# EAGLE design porcupine5v1_2 (EAGLE 5.11)
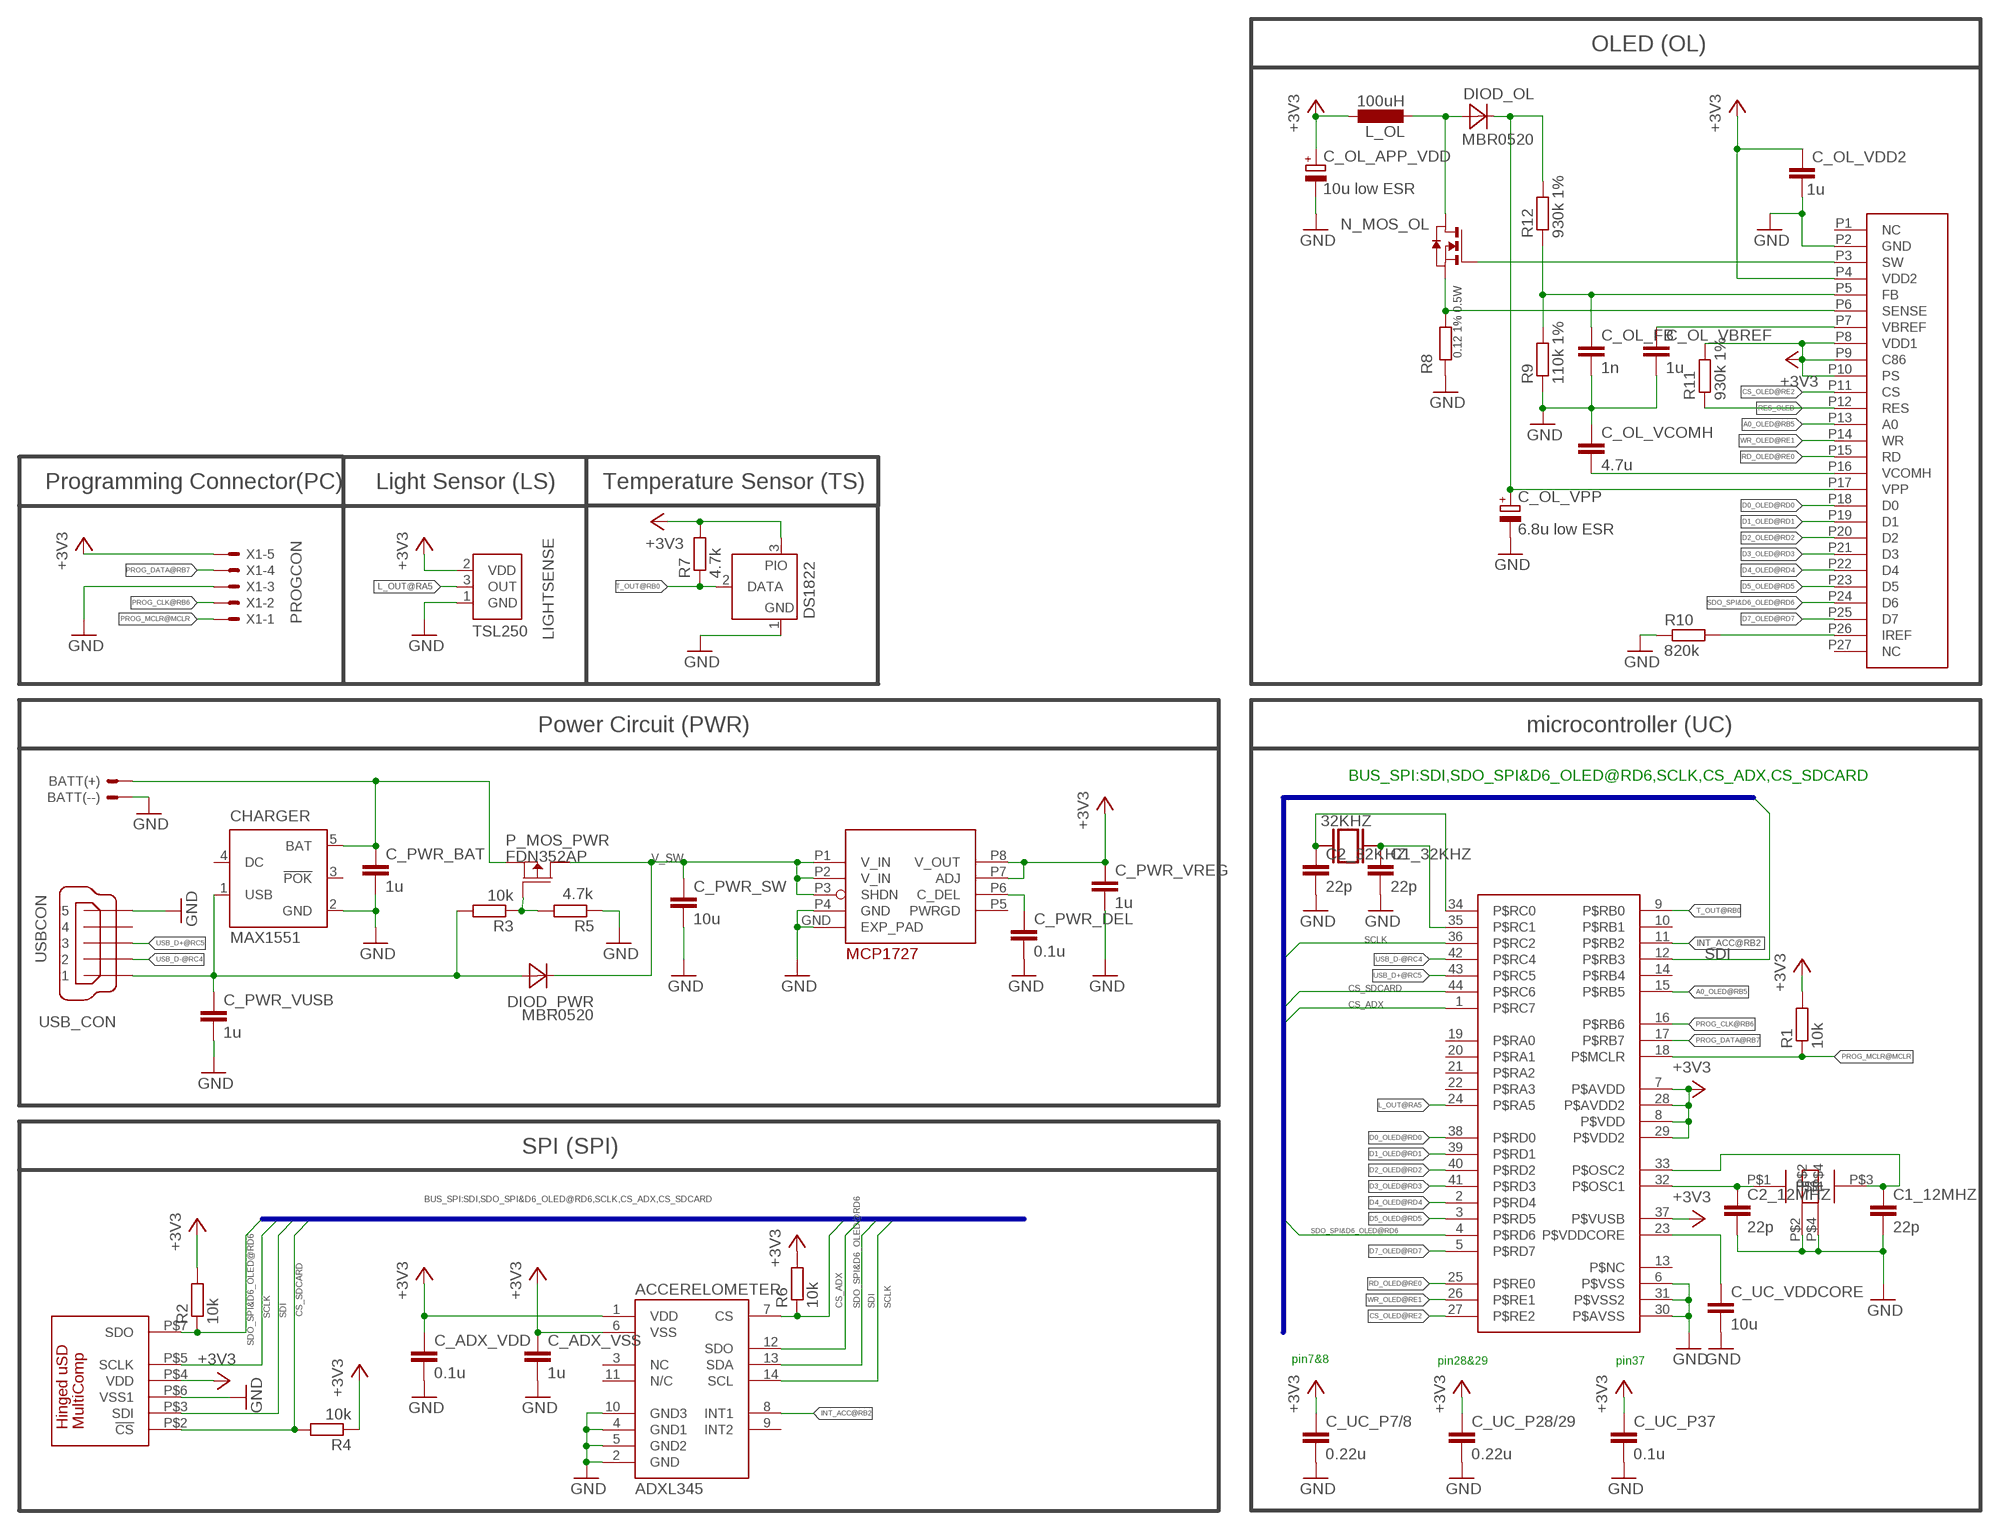
[diagram p0: schematic, sheet 1]

## Parts
ACCERELOMETER  ADXL345  [LGA14]
BATT  LI-ION-PACK  [LI-ION-CONNECT]
C1_12MHZ  22p  C-EUC0603K  [C0603K]
C1_32KHZ  22p  C-EUC0603K  [C0603K]
C2_12MHZ  22p  C-EUC0603K  [C0603K]
C2_32KHZ  22p  C-EUC0603K  [C0603K]
C_ADX_VDD  0.1u  C-EUC0603K  [C0603K]
C_ADX_VSS  1u  C-EUC0603K  [C0603K]
C_OL_APP_VDD  10u low ESR  CPOL-EUA/3216-18R  [A/3216-18R]
C_OL_FB  1n  C-EUC0603K  [C0603K]
C_OL_VBREF  1u  C-EUC0603K  [C0603K]
C_OL_VCOMH  4.7u  C-EUC0603K  [C0603K]
C_OL_VDD2  1u  C-EUC0603K  [C0603K]
C_OL_VPP  6.8u low ESR  CPOL-EUA/3216-18R  [A/3216-18R]
C_PWR_BAT  1u  C-EUC0603K  [C0603K]
C_PWR_DEL  0.1u  C-EUC0603K  [C0603K]
C_PWR_SW  10u  C-EUC0805K  [C0805K]
C_PWR_VREG  1u  C-EUC0603K  [C0603K]
C_PWR_VUSB  1u  C-EUC0603K  [C0603K]
C_UC_P7/8  0.22u  C-EUC0603K  [C0603K]
C_UC_P28/29  0.22u  C-EUC0603K  [C0603K]
C_UC_P37  0.1u  C-EUC0603K  [C0603K]
C_UC_VDDCORE  10u  C-EUC0805K  [C0805K]
CHARGER  MAX1551  [SOT23-5L]
CON_OLED  OLED_DENSITRON  [CON_DD-12864WE-1A]
CRYSTAL_12MHZ  12MHZSMDCRYSTAL  [ABM3B]
CRYSTAL_32KHZ  32KHZ  XTALSLOW  [TC26HSMD]
DIOD_OL  MBR0520  [SOD123]
DIOD_PWR  MBR0520  [SOD123]
L_OL  100uH  LQH3NP  [1212_FOR_INDUCTANCE]
LIGHTSENSE  TSL250  [TSL]
N_MOS_OL  MGSF1N02LT1  [SOT-23]
P_MOS_PWR  FDN352AP  [SUPERSOT-3]
PIC_CONTROLLER  PIC_P2V6  [QFN44ML8X8]
R1  10k  R-EU_R0603  [R0603]
R2  10k  R-EU_R0603  [R0603]
R3  10k  R-EU_R0603  [R0603]
R4  10k  R-EU_R0603  [R0603]
R5  4.7k  R-EU_R0603  [R0603]
R6  10k  R-EU_R0603  [R0603]
R7  4.7k  R-EU_R0603  [R0603]
R8  0.12 1% 0.5W  RESISTOR_PAN_ERJB3CFR12V  [0805_UPSIDEDOWN]
R9  110k 1%  R-EU_R0603  [R0603]
R10  820k  R-EU_R0603  [R0603]
R11  930k 1%  R-EU_R0603  [R0603]
R12  930k 1%  R-EU_R0603  [R0603]
SDCARD_CON  MICROSD_CONN  [460DA40013]
TEMPSENSE  DS1822  DS2405  [TO92-]
USB_CON  USBCON  [248601]
VOLTAGEREG  MCP1727  [MCP_DFN_3X3X0.9]
X1  PROGCON  [53047-05-OCT]

## Nets
+3V3: ACCERELOMETER.1(VDD) ACCERELOMETER.6(VSS) C_ADX_VDD.1 C_ADX_VSS.1 C_OL_APP_VDD.+ C_OL_VDD2.2 C_PWR_VREG.1 C_UC_P7/8.1 C_UC_P28/29.1 C_UC_P37.1 CON_OLED.P4(VDD2) CON_OLED.P8(VDD1) CON_OLED.P9(C86) CON_OLED.P10(PS) L_OL.P$1 LIGHTSENSE.2(VDD) PIC_CONTROLLER.7(P$AVDD) PIC_CONTROLLER.8(P$VDD) PIC_CONTROLLER.28(P$AVDD2) PIC_CONTROLLER.29(P$VDD2) PIC_CONTROLLER.37(P$VUSB) R1.2 R2.2 R4.1 R6.2 R7.2 R11.2 SDCARD_CON.P$4(VDD) TEMPSENSE.3(PIO) VOLTAGEREG.P7(ADJ) VOLTAGEREG.P8(V_OUT) X1.5
A0_OLED@RB5: CON_OLED.P13(A0) PIC_CONTROLLER.15(P$RB5)
CS_ADX: ACCERELOMETER.7(CS) PIC_CONTROLLER.1(P$RC7) R6.1
CS_OLED@RE2: CON_OLED.P11(CS) PIC_CONTROLLER.27(P$RE2)
CS_SDCARD: PIC_CONTROLLER.44(P$RC6) R4.2 SDCARD_CON.P$2(!CS)
D0_OLED@RD0: CON_OLED.P18(D0) PIC_CONTROLLER.38(P$RD0)
D1_OLED@RD1: CON_OLED.P19(D1) PIC_CONTROLLER.39(P$RD1)
D2_OLED@RD2: CON_OLED.P20(D2) PIC_CONTROLLER.40(P$RD2)
D3_OLED@RD3: CON_OLED.P21(D3) PIC_CONTROLLER.41(P$RD3)
D4_OLED@RD4: CON_OLED.P22(D4) PIC_CONTROLLER.2(P$RD4)
D5_OLED@RD5: CON_OLED.P23(D5) PIC_CONTROLLER.3(P$RD5)
D7_OLED@RD7: CON_OLED.P25(D7) PIC_CONTROLLER.5(P$RD7)
GND: ACCERELOMETER.2(GND) ACCERELOMETER.4(GND1) ACCERELOMETER.5(GND2) ACCERELOMETER.10(GND3) BATT.2 C1_12MHZ.2 C1_32KHZ.2 C2_12MHZ.2 C2_32KHZ.2 C_ADX_VDD.2 C_ADX_VSS.2 C_OL_APP_VDD.- C_OL_FB.2 C_OL_VBREF.2 C_OL_VCOMH.1 C_OL_VDD2.1 C_OL_VPP.- C_PWR_BAT.2 C_PWR_DEL.2 C_PWR_SW.2 C_PWR_VREG.2 C_PWR_VUSB.2 C_UC_P7/8.2 C_UC_P28/29.2 C_UC_P37.2 C_UC_VDDCORE.2 CHARGER.2(GND) CON_OLED.P2(GND) CRYSTAL_12MHZ.P$2 CRYSTAL_12MHZ.P$4 LIGHTSENSE.1(GND) PIC_CONTROLLER.6(P$VSS) PIC_CONTROLLER.30(P$AVSS) PIC_CONTROLLER.31(P$VSS2) R5.1 R8.P$2 R9.1 R10.1 SDCARD_CON.P$6(VSS1) TEMPSENSE.1(GND) USB_CON.5 VOLTAGEREG.GND(EXP_PAD) VOLTAGEREG.P4(GND) X1.3
INT_ACC@RB2: ACCERELOMETER.8(INT1) PIC_CONTROLLER.11(P$RB2)
L_OUT@RA5: LIGHTSENSE.3(OUT) PIC_CONTROLLER.24(P$RA5)
N$2: P_MOS_PWR.1(G) R3.1 R5.2
N$3: C2_32KHZ.1 CRYSTAL_32KHZ.P$2 PIC_CONTROLLER.34(P$RC0)
N$4: C_PWR_DEL.1 VOLTAGEREG.P6(C_DEL)
N$6: C1_32KHZ.1 CRYSTAL_32KHZ.P$1 PIC_CONTROLLER.35(P$RC1)
N$8: C_UC_VDDCORE.1 PIC_CONTROLLER.23(P$VDDCORE)
N$10: DIOD_OL.A L_OL.P$2 N_MOS_OL.1(D)
N$11: CON_OLED.P3(SW) N_MOS_OL.3(G)
N$12: C_OL_VPP.+ CON_OLED.P17(VPP) DIOD_OL.C R12.2
N$13: CON_OLED.P6(SENSE) N_MOS_OL.2(S) R8.P$3
N$15: C_OL_FB.1 CON_OLED.P5(FB) R9.2 R12.1
N$18: C_OL_VBREF.1 CON_OLED.P7(VBREF)
N$21: C_OL_VCOMH.2 CON_OLED.P16(VCOMH)
N$30: CON_OLED.P26(IREF) R10.2
OSC3: C2_12MHZ.1 CRYSTAL_12MHZ.P$1 PIC_CONTROLLER.32(P$OSC1)
OSC4: C1_12MHZ.1 CRYSTAL_12MHZ.P$3 PIC_CONTROLLER.33(P$OSC2)
PROG_CLK@RB6: PIC_CONTROLLER.16(P$RB6) X1.2
PROG_DATA@RB7: PIC_CONTROLLER.17(P$RB7) X1.4
PROG_MCLR@MCLR: PIC_CONTROLLER.18(P$MCLR) R1.1 X1.1
RD_OLED@RE0: CON_OLED.P15(RD) PIC_CONTROLLER.25(P$RE0)
RES_OLED: CON_OLED.P12(RES) R11.1
SCLK: ACCERELOMETER.14(SCL) PIC_CONTROLLER.36(P$RC2) SDCARD_CON.P$5(SCLK)
SDI: ACCERELOMETER.13(SDA) PIC_CONTROLLER.12(P$RB3) SDCARD_CON.P$3(SDI)
SDO_SPI&D6_OLED@RD6: ACCERELOMETER.12(SDO) CON_OLED.P24(D6) PIC_CONTROLLER.4(P$RD6) R2.1 SDCARD_CON.P$7(SDO)
T_OUT@RB0: PIC_CONTROLLER.9(P$RB0) R7.1 TEMPSENSE.2(DATA)
USB_D+@RC5: PIC_CONTROLLER.43(P$RC5) USB_CON.3
USB_D-@RC4: PIC_CONTROLLER.42(P$RC4) USB_CON.2
V_BAT: BATT.1 C_PWR_BAT.1 CHARGER.5(BAT) P_MOS_PWR.2(S)
V_SW: C_PWR_SW.1 DIOD_PWR.C P_MOS_PWR.3(D) VOLTAGEREG.P1(V_IN) VOLTAGEREG.P2(V_IN) VOLTAGEREG.P3(SHDN)
VUSB: C_PWR_VUSB.1 CHARGER.1(USB) DIOD_PWR.A R3.2 USB_CON.1
WR_OLED@RE1: CON_OLED.P14(WR) PIC_CONTROLLER.26(P$RE1)
Unconnected: ACCERELOMETER.3(NC) ACCERELOMETER.9(INT2) ACCERELOMETER.11(N/C) BATT.3 CHARGER.3(!POK) CHARGER.4(DC) CON_OLED.P1(NC) CON_OLED.P27(NC) PIC_CONTROLLER.10(P$RB1) PIC_CONTROLLER.13(P$NC) PIC_CONTROLLER.14(P$RB4) PIC_CONTROLLER.19(P$RA0) PIC_CONTROLLER.20(P$RA1) PIC_CONTROLLER.21(P$RA2) PIC_CONTROLLER.22(P$RA3) USB_CON.4 VOLTAGEREG.P5(PWRGD)

## Buses
BUS_SPI:SDI,SDO_SPI&D6_OLED@RD6,SCLK,CS_ADX,CS_SDCARD

## Notes on the sheet
- OLED (OL)
- Programming Connector(PC) | Light Sensor (LS) | Temperature Sensor (TS)
- Power Circuit (PWR) | microcontroller (UC)
- SPI (SPI)
- pin7&8 | pin28&29 | pin37

## Library data of the parts
ACCERELOMETER = HedgehogLib:ADXL345
BATT = HedgehogLib:LI-ION-PACK: Lithium Ion Battery Pack
C1_12MHZ C1_32KHZ C2_12MHZ C2_32KHZ C_ADX_VDD C_ADX_VSS C_OL_FB C_OL_VBREF C_OL_VCOMH C_OL_VDD2 C_PWR_BAT C_PWR_DEL C_PWR_SW C_PWR_VREG C_PWR_VUSB C_UC_P7/8 C_UC_P28/29 C_UC_P37 C_UC_VDDCORE = rcl:C-EU: CAPACITOR, European symbol
C_OL_APP_VDD C_OL_VPP = rcl:CPOL-EU: POLARIZED CAPACITOR, European symbol
CHARGER = maxim:MAX1551: Dual-Input USB/AC Adapter 1-Cell Li+ Battery Chargers Source: http://www.maxim-ic.com .. MAX1551-MAX1555.pdf
CON_OLED = HedgehogLib:OLED_DENSITRON
CRYSTAL_12MHZ = HedgehogLib:12MHZSMDCRYSTAL
CRYSTAL_32KHZ = HedgehogLib:XTAL
DIOD_OL DIOD_PWR = HedgehogLib:MBR0520
L_OL = HedgehogLib:LQH3NP
LIGHTSENSE = HedgehogLib:TSL250
N_MOS_OL = HedgehogLib:MGSF1N02LT1: MOS FET
P_MOS_PWR = HedgehogLib:FDN352AP
PIC_CONTROLLER = HedgehogLib:PIC_P2V6
R1-R7 R9-R12 = rcl:R-EU_: RESISTOR, European symbol
R8 = HedgehogLib:RESISTOR_PAN_ERJB3CFR12V
SDCARD_CON = HedgehogLib:MICROSD_CONN
TEMPSENSE = maxim:DS2405: Addressable Switch DALLAS Semiconductor
USB_CON = HedgehogLib:USBCON: MINI USB 2.0 Connector TypeB
VOLTAGEREG = HedgehogLib:MCP1727
X1 = HedgehogLib:PROGCON: Programmer Connector wire to board 1.25 mm (.049 inch) pitch header

## Board
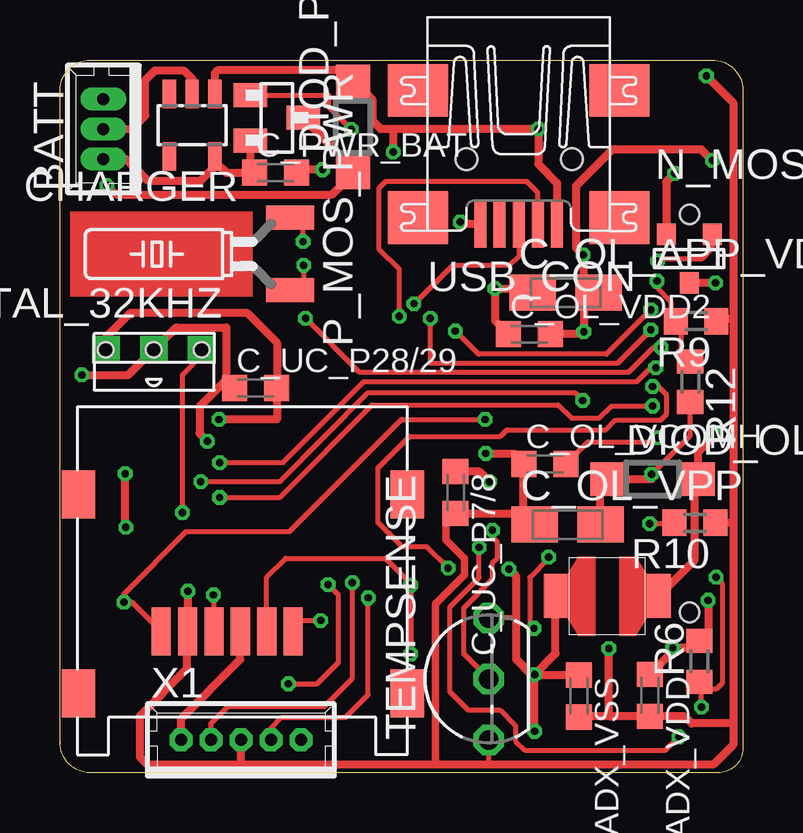
[diagram p1: board, top side]
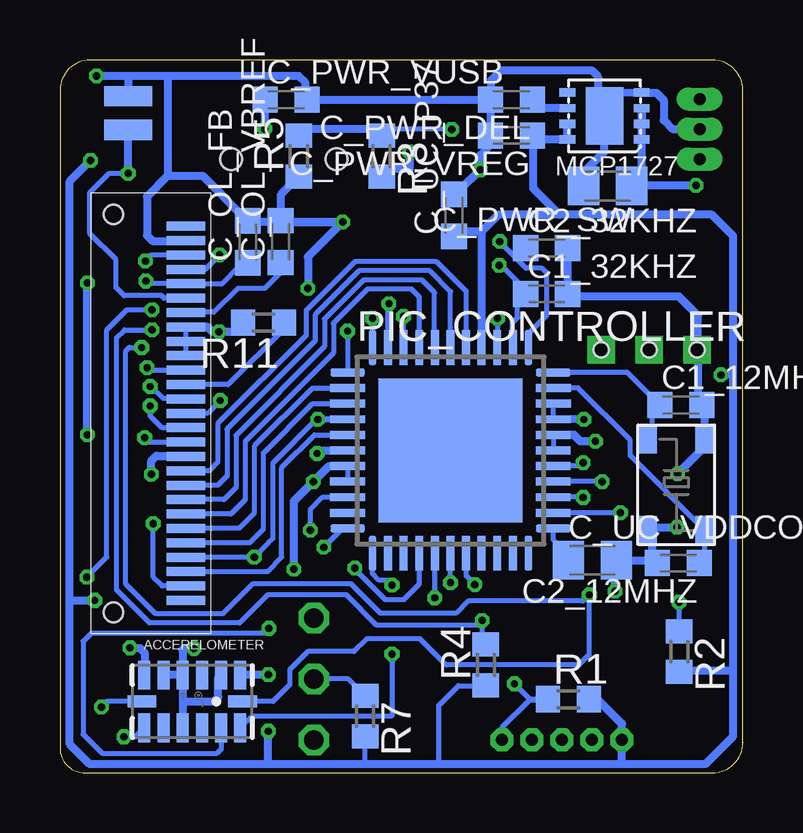
[diagram p2: board, bottom side, seen from below]

Size 28.47 x 29.72 mm. Coordinates in mm from the lower left corner, seen from the top.
Outline: 0,1.27 arc90 1.27,0 27.43,0 arc90 28.47,1.02 28.47,28.45 arc90 27.2,29.72 1.27,29.72 arc90 0,28.45 0,1.27
Outline: 0,1.27 0,1.25
Copper layers (1*16): Top 0.035mm / dielectric 1.5mm / Bottom 0.035mm
Design rules "default *": minimum track width 6mil, minimum drill 12mil, track to track 7mil, track to pad 7mil, pad to pad 7mil, via to via 7mil, smd to smd 7mil, copper to edge 6mil, drill to drill 6mil, minimum pad ring 9mil, minimum via ring 6mil, stop-mask expansion 6mil, vias tented up to drill 0mil, thermal gap 10mil

### Footprints (pad centres in the part's own frame; a part is rotated, then mirrored left to right if it is on the bottom)
LGA14 = smd 0.5 x 1.2: 1 2,1.1; 2 1.2,1.1; 3 0.4,1.1; 4 -0.4,1.1; 5 -1.2,1.1; 6 -2,1.1; 8 -2,-1.1; 9 -1.2,-1.1; 10 -0.4,-1.1; 11 0.4,-1.1; 12 1.2,-1.1; 13 2,-1.1 | smd 1.2 x 0.5: 7 -2.1,0; 14 2.1,0
LI-ION-CONNECT = drill 0.5 pad 0.698 long: 1 -2.5,0; 2 -1.25,0; 3 0,0
C0603K = smd 1.05 x 1.08: 1 -0.875,0; 2 0.875,0
A/3216-18R = smd 1.95 x 1.5: + 1.375,0; - -1.375,0
C0805K = smd 1.3 x 1.6: 1 -1,0; 2 1,0
SOT23-5L = smd 0.55 x 1.2: 1 -0.95,-1.3; 2 0,-1.3; 3 0.95,-1.3; 4 0.95,1.3; 5 -0.95,1.3
CON_DD-12864WE-1A = smd 0.375 x 1.6: P1 7.8,0; P2 7.2,0; P3 6.6,0; P4 6,0; P5 5.4,0; P6 4.8,0; P7 4.2,0; P8 3.6,0; P9 3,0; P10 2.4,0; P11 1.8,0; P12 1.2,0; P13 0.6,0; P14 0,0; P15 -0.6,0; P16 -1.2,0; P17 -1.8,0; P18 -2.4,0; P19 -3,0; P20 -3.6,0; P21 -4.2,0; P22 -4.8,0; P23 -5.4,0; P24 -6,0; P25 -6.6,0; P26 -7.2,0; P27 -7.8,0 | hole 0.8: -8.3,3.025; 8.3,3.025
ABM3B = smd 1.2 x 0.8: P$1 0.6,0.4; P$2 4.4,0.4; P$3 4.4,2.8; P$4 0.6,2.8
TC26HSMD = smd 1 x 2: P$1 -1.5,-0.8; P$2 1.522,-0.8
SOD123 = smd 1.4 x 1.4: A 1.9,0; C -1.9,0
1212_FOR_INDUCTANCE = smd 1 x 1.8: P$1 -2.65,-1.65; P$2 1.65,-1.65
TSL = drill 0.635 pad 1.15 square: 1 -1.999,0; 2 0,0; 3 1.999,0 | hole 0.635: 0,0; -2,0; 2,0
SOT-23 = smd 0.787 x 0.889: 1 0.025,-1.016; 2 -0.94,1.016; 3 0.991,1.016
SUPERSOT-3 = smd 1 x 1.4: 1 -0.95,-1.1; 2 0.95,-1.1; 3 0,1.1
QFN44ML8X8 = smd 1.45 x 0.33: 1 -4.282,3.25; 2 -4.285,2.6; 3 -4.285,1.95; 4 -4.285,1.3; 5 -4.285,0.65; 6 -4.287,0; 7 -4.285,-0.649; 8 -4.287,-1.3; 9 -4.287,-1.949; 10 -4.285,-2.6; 11 -4.285,-3.25; 23 4.285,-3.25; 24 4.287,-2.6; 25 4.287,-1.95; 26 4.287,-1.3; 27 4.287,-0.652; 28 4.287,0; 29 4.287,0.65; 30 4.292,1.3; 31 4.293,1.953; 32 4.293,2.602; 33 4.285,3.25 | smd 0.33 x 1.45: 12 -3.25,-4.288; 13 -2.6,-4.287; 14 -1.949,-4.287; 15 -1.3,-4.287; 16 -0.65,-4.287; 17 0,-4.287; 18 0.65,-4.287; 19 1.3,-4.287; 20 1.95,-4.287; 21 2.6,-4.287; 22 3.25,-4.285; 34 3.25,4.288; 35 2.6,4.287; 36 1.95,4.287; 37 1.3,4.285; 38 0.65,4.287; 39 0,4.287; 40 -0.649,4.287; 41 -1.3,4.287; 42 -1.949,4.287; 43 -2.6,4.287; 44 -3.25,4.288 | smd 6 x 6: EXP 0,0
R0603 = smd 1 x 1.1: 1 -0.85,0; 2 0.85,0
0805_UPSIDEDOWN = smd 2 x 0.85: P$2 0,0.7; P$3 0,-0.7
460DA40013 = smd 2 x 0.8: P$2 9.35,-4.75; P$3 9.35,-5.85; P$4 9.35,-6.95; P$5 9.35,-8.05; P$6 9.35,-9.15; P$7 9.35,-10.25 | smd 2 x 1.4: P$9A 11.95,0; P$9B 3.65,0; P$10A 11.95,-13.7; P$10B 3.65,-13.7
TO92- = drill 0.813 octagon: 1 -2.54,0; 2 0,0; 3 2.54,0
248601 = smd 2 x 0.5: 1 2.25,1.6; 2 2.25,0.8; 3 2.25,0; 4 2.25,-0.8; 5 2.25,-1.6 | smd 2.2 x 2.5: M1 -3.3,-4.2; M2 -3.3,4.2; M3 2,4.2; M4 2,-4.2 | hole 0.9: -0.449,-2.177; -0.447,2.21
MCP_DFN_3X3X0.9 = smd 2.4 x 1.55: GND 0,-1.55 | smd 0.35 x 0.65: P1 0.975,0; P2 0.325,0; P3 -0.325,0; P4 -0.975,0; P5 -0.975,-3.1; P6 -0.325,-3.1; P7 0.325,-3.1; P8 0.975,-3.1
53047-05-OCT = drill 0.5 pad 0.889 octagon: 1 2.5,0; 2 1.25,0; 3 0,0; 4 -1.25,0; 5 -2.5,0

### Placement (x,y rotation side)
ACCERELOMETER  22.95,2.97 0 bottom
BATT  1.8,28.09 90 top
C1_12MHZ  2.59,15.33 0 bottom
C1_32KHZ  8.18,19.96 0 bottom
C2_12MHZ  2.7,8.74 180 bottom
C2_32KHZ  8.18,21.87 0 bottom
C_ADX_VDD  24.59,3.23 270 top
C_ADX_VSS  21.63,3.2 270 top
C_OL_APP_VDD  21.09,20.01 0 top
C_OL_FB  20.64,22.13 90 bottom
C_OL_VBREF  19.27,22.14 90 bottom
C_OL_VCOMH  20.22,12.87 0 top
C_OL_VDD2  19.58,18.28 0 top
C_OL_VPP  21.16,10.35 0 top
C_PWR_BAT  8.99,25.02 0 top
C_PWR_DEL  9.65,28.07 180 bottom
C_PWR_SW  5.64,24.46 180 bottom
C_PWR_VREG  9.65,26.57 180 bottom
C_PWR_VUSB  19.05,28.07 0 bottom
C_UC_P7/8  16.5,11.68 270 top
C_UC_P28/29  8.16,16.04 0 top
C_UC_P37  12.04,23.24 90 bottom
C_UC_VDDCORE  6.27,8.86 0 bottom
CHARGER  5.51,27 180 top
CON_OLED  23.22,14.99 90 bottom
CRYSTAL_12MHZ  1.18,9.51 90 bottom
CRYSTAL_32KHZ  8.8,21.62 90 top
DIOD_OL  24.71,12.24 0 top
DIOD_PWR  12.22,26.92 90 top
L_OL  23.32,9.02 0 top
LIGHTSENSE  3.91,17.64 0 top
N_MOS_OL  26.21,21.44 0 top
P_MOS_PWR  9.04,27.3 270 top
PIC_CONTROLLER  12.19,13.44 0 bottom
R1  7.28,3.06 0 bottom
R2  2.65,5.05 270 bottom
R3  15.06,25.7 270 bottom
R4  10.72,4.49 90 bottom
R5  18.52,25.7 90 bottom
R6  26.66,4.64 90 top
R7  15.75,2.36 270 bottom
R8  25.63,27.51 0 bottom
R9  26.52,18.82 180 top
R10  26.47,10.42 180 top
R11  19.99,18.77 180 bottom
R12  26.27,16.3 270 top
SDCARD_CON  14.47,15.26 270 top
TEMPSENSE  17.88,3.91 90 top
USB_CON  19.13,25.14 270 top
VOLTAGEREG  4.22,27.38 270 bottom
X1  7.54,1.37 0 top

### Tracks (layer width: path | path; a pad name or v marks a point on that pad's centre or on a via)
+3V3  (via drill 0.3)
  Top 0.203: 21.84,19.86 21.99,20.01 C_OL_APP_VDD.+ 21.82,20.65 | 19.02,6.45 TEMPSENSE.3 | R6.2 26.84,5.31
  Top 0.33: SDCARD_CON.P$4 7.52,4.72 5.04,2.25 X1.5 | v6.15,13.82 5.82,14.15 5.82,15.27 6.93,16.38 | 20.53,18.36 C_OL_VDD2.2 21.79,18.28 v21.84,18.39 21.84,19.86 | C_UC_P7/8.1 17.49,12.56 v17.91,12.14 | v25.55,5.21 v25.56,5.21 | v19.79,4.09 20.67,4.97 L_OL.P$1 | v25.55,5.21 26.75,5.21 26.84,5.31 27.03,5.51 v27.03,7.19 | 6.93,16.38 6.93,18.57 4.85,18.57 4.16,17.88 LIGHTSENSE.2 2.87,16.6 2.87,16.59 v0.91,16.59 | v25.55,5.21 25.57,5.19 | 21.82,20.65 v21.82,21.59 21.51,21.89 21.51,24.46 23.04,25.98 26.75,25.98 v27.2,25.53 | v18.72,8.48 19.02,8.18 19.02,6.45 19.02,4.72 19.66,4.09 v19.79,4.09 | 6.93,16.38 C_UC_P28/29.1 | v19.79,4.09 21.62,4.09 C_ADX_VSS.1 | v19.79,1.73 v19.79,4.09 | C_ADX_VDD.1 25.55,5.06 v25.55,5.21
  Bottom 0.203: PIC_CONTROLLER.8 | PIC_CONTROLLER.8 | PIC_CONTROLLER.37 10.87,17.75 10.9,17.77 | PIC_CONTROLLER.8 16.62,12.14 | ACCERELOMETER.1 20.93,4.1 | PIC_CONTROLLER.29 PIC_CONTROLLER.28 | CON_OLED.P4 22.42,20.99 v21.82,21.59 | R4.1 10.73,3.63 11.86,3.63 12.68,2.82 12.68,0.36 | CON_OLED.P8 CON_OLED.P9 CON_OLED.P10 | 15.75,0.36 R7.2 | 11.72,22.55 arc-90 C_UC_P37.1 | PIC_CONTROLLER.7 PIC_CONTROLLER.8
  Bottom 0.33: VOLTAGEREG.P7 VOLTAGEREG.P8 8.72,26.41 C_PWR_VREG.1 8.74,26.56 8.74,24.36 7.64,23.27 | v6.15,13.82 6.78,13.82 7.04,14.09 PIC_CONTROLLER.29 | R1.2 6.39,3.05 6.04,3.05 5.04,2.05 X1.5 5.05,1.18 5.05,0.36 | 7.64,23.27 1.29,23.27 0.41,22.38 0.41,16.61 | 0.41,4.24 0.41,1.52 1.57,0.36 5.05,0.36 | 0.41,4.24 0.41,16.61 | 24.96,4.06 ACCERELOMETER.6 24.94,4.09 24.94,5 25.15,5.21 v25.55,5.21 | v19.79,4.09 20.94,4.09 ACCERELOMETER.1 | 5.05,0.36 12.68,0.36 15.75,0.36 19.79,0.36 | R2.2 2.61,4.24 0.41,4.24 | 0.41,16.61 v0.91,16.59 | v18.72,8.48 18.72,11.33 v17.91,12.14 17.26,12.79 PIC_CONTROLLER.7 | CON_OLED.P8 22.33,18.59 22.12,18.39 v21.84,18.39 21.27,18.39 R11.2 | 7.64,23.27 10.19,23.27 10.9,22.55 | 10.9,22.55 10.9,17.77 | 19.79,0.36 27.23,0.36 28.07,1.19 28.07,7.19 | 28.07,7.19 v27.03,7.19 | 19.79,0.36 v19.79,1.73 | 10.9,22.55 11.72,22.55 | 28.07,7.19 28.07,24.66 v27.2,25.53
A0_OLED@RB5  (via drill 0.3)
  Top 0.203: v16.18,8.53 15.29,9.42 14.28,9.42 13.26,10.44 13.26,12.7 14.58,14.02 18.36,14.02 18.64,14.3 22.76,14.3 23.16,14.71 25.04,14.71 25.3,14.96 25.3,15.75 24.94,16.1 v24.71,16.1
  Bottom 0.203: CON_OLED.P13 23.79,15.59 23.82,15.62 24.18,15.62 24.66,16.1 v24.71,16.1 | v16.18,8.53 16.18,8.48 14.91,7.21 14.15,7.21 13.49,7.87 PIC_CONTROLLER.15
CS_ADX  (via drill 0.3)
  Top 0.203: v24.64,19.3 22.78,17.45 17.45,17.45 v16.48,18.41 | v26.75,2.74 26.75,3.42 R6.1 26.67,3.5 27.38,3.5 27.64,3.76 27.64,7.87 v27.36,8.15
  Bottom 0.203: 25.08,2.95 ACCERELOMETER.7 26.52,2.97 v26.75,2.74 | v24.64,19.3 25.68,19.3 26.52,18.47 26.52,8.99 27.33,8.18 v27.36,8.15 | v16.48,18.41 PIC_CONTROLLER.1
CS_OLED@RE2  (via drill 0.3)
  Top 0.203: v6.66,12.93 9.3,12.93 12.68,16.31 24.05,16.31 24.64,16.89 v24.84,16.89
  Bottom 0.203: PIC_CONTROLLER.27 6.8,12.79 v6.66,12.93 | CON_OLED.P11 24.74,16.79 v24.84,16.89
CS_SDCARD  (via drill 0.3)
  Top 0.203: v15.44,18.95 15.44,17.07 23.24,17.07 v24.64,18.47 | v10.87,6.35 10.03,6.35 9.73,6.34 SDCARD_CON.P$2
  Bottom 0.203: PIC_CONTROLLER.44 v15.44,18.95 | R4.2 10.87,5.5 v10.87,6.35 11.07,6.15 15.27,6.15 16.54,7.42 19.81,7.42 20.98,6.25 24.74,6.25 26.11,7.62 26.11,18.14 25.78,18.47 v24.64,18.47
D0_OLED@RD0
  Bottom 0.203: CON_OLED.P18 22.26,12.59 21.89,12.95 21.89,14.55 18.21,18.24 18.21,19.28 16.18,21.31 12.78,21.31 11.53,20.07 PIC_CONTROLLER.38
D1_OLED@RD1
  Bottom 0.203: CON_OLED.P19 21.89,11.99 21.51,12.37 21.51,14.33 17.83,18.01 17.83,19.1 16,20.93 13.06,20.93 12.19,20.07 PIC_CONTROLLER.39
D2_OLED@RD2
  Bottom 0.203: CON_OLED.P20 21.63,11.39 21.13,11.89 21.13,14.07 17.45,17.78 17.45,18.92 15.82,20.55 13.39,20.55 12.85,20.02 12.85,17.73 PIC_CONTROLLER.40
D3_OLED@RD3
  Bottom 0.203: PIC_CONTROLLER.41 13.49,19.84 13.82,20.17 15.65,20.17 17.07,18.75 17.07,17.5 20.75,13.82 20.75,11.38 21.34,10.79 CON_OLED.P21
D4_OLED@RD4
  Bottom 0.203: PIC_CONTROLLER.2 16.49,16.03 17.96,16.03 20.37,13.61 20.37,10.82 21,10.19 CON_OLED.P22
D5_OLED@RD5
  Bottom 0.203: CON_OLED.P23 20.56,9.59 19.99,10.16 19.99,13.34 17.93,15.39 PIC_CONTROLLER.3
D7_OLED@RD7
  Bottom 0.203: PIC_CONTROLLER.5 17.86,14.09 19.23,12.72 19.23,8.99 19.84,8.38 CON_OLED.P25
GND  (via drill 0.3)
  Top 0.203: v2.74,10.24 2.72,10.26 | C_OL_VCOMH.1 19.35,12.94 19,13.28 | 17.88,0.36 TEMPSENSE.1
  Top 0.305: 15.65,0.36 15.65,7.04 16.87,8.26 16.87,8.94 16.1,9.7 16.1,10.41 C_UC_P7/8.2
  Top 0.33: USB_CON.5 16.75,22.89 v16.69,22.96 | 2.72,10.26 v2.72,12.47 | v6.63,14.73 9.04,14.73 C_UC_P28/29.2 9.04,16.02 9.04,17.93 7.8,19.18 2.94,19.18 1.92,18.16 1.92,17.75 LIGHTSENSE.1 | v10.95,25.15 10.08,25.15 C_PWR_BAT.2 | 19.33,10.81 C_OL_VPP.- | C_UC_P7/8.2 19.33,10.81 | C_OL_VCOMH.1 19.33,12.85 19.33,10.81 | C_OL_VPP.- 19.79,10.09 | C_OL_VPP.- 19.64,10.35 | C_OL_VDD2.1 18.14,18.85 v18.14,20.19 19.53,20.19 C_OL_APP_VDD.- | R9.1 27.47,18.92 27.96,18.92 28.09,19.05 | 27.34,10.44 R10.1 28.09,10.42 28.09,10.41 | v17.75,13.31 17.78,13.28 19,13.28 | 7.54,0.36 15.65,0.36 17.88,0.36 27.25,0.36 28.09,1.19 28.09,2.06 | 7.54,0.36 X1.3 | v5.33,7.57 5.33,5.92 SDCARD_CON.P$6 5.31,5.89 5.31,4.34 3.33,2.36 3.33,0.66 3.63,0.36 7.54,0.36 | 28.09,2.06 28.09,10.41 | 28.09,10.41 28.09,19.05 | CHARGER.2 5.51,28.93 5.16,29.29 3.96,29.29 3.56,28.88 3.56,27.4 3,26.85 BATT.2 | 28.09,19.05 28.09,27.91 v26.95,29.06 | 22.95,2.35 21.66,2.35 C_ADX_VSS.2 | 22.95,2.35 C_ADX_VDD.2 26.04,2.35 26.34,2.06 28.09,2.06 | 22.95,2.35 22.89,2.42 v22.89,5.18
  Bottom 0.203: LIGHTSENSE.1 1.87,17.68 | 1.58,15.04 C1_12MHZ.2 1.91,15.52 | CRYSTAL_12MHZ.P$4 3.85,10.24 | 1.58,13.61 CRYSTAL_12MHZ.P$2 | PIC_CONTROLLER.6 | 11.81,24.28 C_UC_P37.2 | PIC_CONTROLLER.30 PIC_CONTROLLER.31
  Bottom 0.33: C_PWR_DEL.2 C_PWR_VREG.2 10.67,26.48 10.67,26.04 10.95,25.76 v10.95,25.15 11.81,24.28 | ACCERELOMETER.4 23.36,3.02 | 23.36,3.02 ACCERELOMETER.10 | ACCERELOMETER.4 ACCERELOMETER.5 | 23.36,3.02 23.3,2.97 22.05,2.97 21.87,3.15 21.87,3.96 ACCERELOMETER.2 | v5.33,7.57 5.33,8.97 C_UC_VDDCORE.2 3.92,8.86 C2_12MHZ.2 3.79,8.79 3.8,10.11 CRYSTAL_12MHZ.P$4 | CRYSTAL_12MHZ.P$2 1.58,15.04 | 3.85,10.24 v2.74,10.24 | v2.72,12.47 1.58,13.61 | 1.87,17.68 1.87,19.07 2.67,19.86 7.2,19.86 C1_32KHZ.2 C2_32KHZ.2 | 1.91,15.52 1.91,15.65 1.85,15.54 1.85,17.52 LIGHTSENSE.1 | CON_OLED.P2 23.24,22.17 24.61,22.17 24.84,22.4 24.84,24.03 23.98,24.89 | PIC_CONTROLLER.6 17.63,13.44 v17.75,13.31 | v22.89,5.18 23.32,5.18 23.37,5.13 23.37,4.09 ACCERELOMETER.4 | v16.69,22.96 18.82,22.96 C_OL_VBREF.2 19.32,23.01 19.46,22.99 20.62,22.99 C_OL_FB.2 22.52,24.89 23.98,24.89 | v16.69,22.96 18.14,21.51 v18.14,20.19 | 18.26,27.98 18.26,28.8 18.52,29.06 23.98,29.06 | 18.26,27.98 C_PWR_VUSB.2 18.19,28.06 | 6.05,28.38 VOLTAGEREG.P4 3.61,28.35 3.3,28.04 3.3,27.2 2.94,26.84 BATT.2 | 6.05,28.38 6.05,29.04 6.3,29.29 10.08,29.29 10.49,28.88 10.49,28.1 C_PWR_DEL.2 | C_PWR_SW.2 6.64,25.03 5.79,25.88 5.79,27.68 VOLTAGEREG.GND 6.04,27.76 6.05,28.38 | v6.63,14.73 PIC_CONTROLLER.30 | 18.26,27.98 C_PWR_VUSB.2 C_PWR_DEL.2 | 18.26,27.98 18.25,27.96 | 23.98,29.06 23.98,24.89 | v26.95,29.06 25.6,29.06 | 25.6,29.06 23.98,29.06 | R8.P$2 25.63,29.03 25.6,29.06 | v16.69,22.96 19.25,22.96 19.25,24.12 R5.1
INT_ACC@RB2  (via drill 0.3)
  Top 0.203: v25.81,1.5 25.25,0.94 19.38,0.94 19,1.32 19,1.96 18.34,2.62 17.02,2.62 16.26,3.38 16.26,6.91 17.48,8.13 v17.48,9.4
  Bottom 0.203: ACCERELOMETER.8 25.33,1.5 v25.81,1.5 | v17.48,9.4 16.68,10.19 PIC_CONTROLLER.11
L_OUT@RA5  (via drill 0.3)
  Top 0.203: v5.11,10.85 5.11,16.59 5.91,17.39 LIGHTSENSE.3
  Bottom 0.203: v5.11,10.85 5.12,10.84 PIC_CONTROLLER.24
N$2  (via drill 0.3)
  Top 0.203: v12.14,26.82 11.2,27.76 11.2,28.25 7.95,28.25 P_MOS_PWR.1
  Bottom 0.203: v12.14,26.82 15.06,26.82
  Bottom 0.33: R5.2 18.52,26.62 18.31,26.82 15.06,26.82 R3.1
N$3  (via drill 0.3)
  Top 0.203: v10.13,22.15 10.13,22.76 9.75,23.15 CRYSTAL_32KHZ.P$2
  Bottom 0.203: 9.45,21.44 9.22,21.67 C2_32KHZ.1 | 9.45,21.44 9.04,21.03 8.38,21.03 8.18,20.83 8.18,19.07 8.95,18.31 PIC_CONTROLLER.34 | 9.45,21.44 10.13,22.12 v10.13,22.15
N$4
  Bottom 0.33: VOLTAGEREG.P6 8.54,27.71 C_PWR_DEL.1
N$6  (via drill 0.3)
  Top 0.203: 10.16,20.15 CRYSTAL_32KHZ.P$1 9.68,19.96 10.13,19.96 10.13,20.12 10.16,20.12 v10.16,21.16 10.16,20.15
  Bottom 0.203: 9.4,20.47 9.05,20.13 C1_32KHZ.1 | 9.4,20.47 9.4,18.97 9.6,18.77 9.6,17.73 PIC_CONTROLLER.35 | 9.4,20.47 10.08,21.16 v10.16,21.16
N$8
  Bottom 0.203: C_UC_VDDCORE.1 7.91,9.73 PIC_CONTROLLER.23
N$10  (via drill 0.3)
  Top 0.33: v27.33,14.1 26.61,13.37 DIOD_OL.A 26.61,11.87 26.47,11.73 26.47,8.87 L_OL.P$2 | v27.33,20.42 N_MOS_OL.1
  Bottom 0.33: v27.33,14.1 v27.33,20.42
N$11  (via drill 0.3)
  Top 0.203: 27.2,22 N_MOS_OL.3 27.2,21.84 26.8,21.44 25.15,21.44 24.99,21.34 v24.92,21.34
  Bottom 0.203: CON_OLED.P3 24.66,21.59 v24.92,21.34
N$12  (via drill 0.3)
  Top 0.203: R12.2 26.27,14.06 v24.66,12.45
  Top 0.33: v24.66,12.45 24.66,12.24 DIOD_OL.C 22.54,11.98 C_OL_VPP.+
  Bottom 0.33: CON_OLED.P17 23.24,13.21 24.46,13.21 24.66,13.01 v24.66,12.45
N$13  (via drill 0.3)
  Top 0.33: N_MOS_OL.2 25.27,24.64 v25.63,24.99
  Bottom 0.203: CON_OLED.P6 24.13,19.79 24.23,19.89 25.81,19.89 26.14,20.22 26.14,21.39 27.23,22.48 27.23,24.18 26.42,24.99 v25.63,24.99
  Bottom 0.33: v25.63,24.99 R8.P$3
N$15  (via drill 0.3)
  Top 0.203: v24.89,20.5 24.89,20.22 25.48,19.63 25.48,19.02 R9.2 25.88,18.82 25.88,17.54 R12.1
  Bottom 0.203: 23.74,20.39 23.77,20.42 23.93,20.42 23.95,20.4 24.79,20.4 v24.89,20.5 | CON_OLED.P5 23.21,20.37 21.74,20.37 21.02,21.1 20.9,21.36 C_OL_FB.1
  Bottom 0.33: CON_OLED.P5 23.74,20.39
N$18
  Bottom 0.203: CON_OLED.P7 23.21,19.2 22.05,19.2 21.06,20.19 19.94,20.19 19.27,20.86 C_OL_VBREF.1
N$21  (via drill 0.3)
  Top 0.203: v24.94,13.97 24.77,13.79 22.02,13.79 C_OL_VCOMH.2
  Bottom 0.203: v24.94,13.97 24.76,13.79 CON_OLED.P16
N$30  (via drill 0.3)
  Top 0.203: R10.2 25.59,10.39 v24.59,10.39
  Bottom 0.203: v24.59,10.39 24.59,8.15 24.22,7.79 CON_OLED.P26
OSC3
  Bottom 0.203: PIC_CONTROLLER.32 6.87,16.04 4.7,13.87 4.7,13.23 CRYSTAL_12MHZ.P$1 1.58,8.98 C2_12MHZ.1
OSC4
  Bottom 0.203: PIC_CONTROLLER.33 4.83,16.69 C1_12MHZ.1 3.79,15.01 3.79,14.33 3.8,13.99 CRYSTAL_12MHZ.P$3
PROG_CLK@RB6  (via drill 0.3)
  Top 0.203: v12.85,7.29 12.85,3.25 11.91,2.31 9.25,2.31 8.79,1.86 X1.2
  Bottom 0.203: v12.85,7.29 12.85,7.27 PIC_CONTROLLER.16
PROG_DATA@RB7  (via drill 0.3)
  Top 0.203: v12.19,7.92 12.19,3.94 11.02,2.77 7.01,2.77 6.29,2.05 X1.4
  Bottom 0.203: v12.19,7.92 v12.2,7.93 PIC_CONTROLLER.17
PROG_MCLR@MCLR  (via drill 0.3)
  Top 0.203: v9.53,3.71 10.72,3.71 11.61,4.6 11.61,7.42 v11.18,7.85
  Bottom 0.203: X1.1 10.04,1.89 8.89,3.05 8.14,3.05 R1.1 8.88,3.06 v9.53,3.71 | v11.18,7.85 11.53,8.2 11.53,9.14 PIC_CONTROLLER.18
RD_OLED@RE0  (via drill 0.3)
  Top 0.203: v6.66,11.48 9.17,11.48 13.01,15.34 20.78,15.34 21.34,14.78 22.48,14.78 22.99,15.29 v24.71,15.29
  Bottom 0.203: PIC_CONTROLLER.25 6.66,11.49 v6.66,11.48 | CON_OLED.P15 23.24,14.4 24.23,14.4 24.71,14.88 v24.71,15.29
RES_OLED
  Bottom 0.203: CON_OLED.P12 21.46,16.18 19.14,18.5 R11.1
SCLK  (via drill 0.3)
  Top 0.203: v10.24,18.95 12.5,16.69 23.7,16.69 24.74,17.73 v25.07,17.73 | SDCARD_CON.P$5 6.4,5.91 v6.4,7.42
  Bottom 0.203: v10.24,18.95 PIC_CONTROLLER.36 | 20.78,2.97 ACCERELOMETER.14 20.86,2.95 20.83,2.97 19.58,2.97 18.9,3.66 18.9,4.29 18.14,5.05 16.2,5.05 15.67,5.59 13.46,5.59 12.37,4.5 6.83,4.5 6.4,4.93 v6.4,7.42 6.66,7.16 11.46,7.16 11.96,6.66 15.11,6.66 16.33,7.87 20.45,7.87 21.69,6.63 24.49,6.63 25.73,7.87 25.73,17.58 25.58,17.73 v25.07,17.73
SDI  (via drill 0.3)
  Top 0.203: SDCARD_CON.P$3 8.62,8.16 9.4,8.94 13.56,8.94 14.63,7.87 v14.63,7.82 v14.63,4.95
  Bottom 0.203: PIC_CONTROLLER.12 15.44,8.31 15.16,8.03 14.83,8.03 v14.63,7.82 | ACCERELOMETER.13 20.93,1.85 | ACCERELOMETER.13 21.03,1.8 | v14.63,4.95 14.63,2.36 20.47,2.36 ACCERELOMETER.13
SDO_SPI&D6_OLED@RD6  (via drill 0.3)
  Top 0.203: SDCARD_CON.P$7 3.02,7.11 v2.67,7.11 2.67,7.47 5.26,10.06 9.58,10.06 14.25,14.73 v17.73,14.73 | v20.37,8.99 20.37,8.94 19.58,8.15 19.58,6.2 v19.76,6.02
  Bottom 0.203: v2.67,7.11 2.65,7.1 R2.1 | CON_OLED.P24 v20.37,8.99 19.79,9.57 19.61,9.75 19.61,12.9 17.77,14.74 PIC_CONTROLLER.4 v17.73,14.73 | 21.77,1.86 ACCERELOMETER.12 21.74,0.99 21.92,0.81 26.72,0.81 27.51,1.6 27.51,5.49 27.18,5.82 19.96,5.82 v19.76,6.02
T_OUT@RB0  (via drill 0.3)
  Top 0.203: TEMPSENSE.2 16.84,4.95 16.84,6.88 18.03,8.08 18.03,8.76 18.24,8.97 18.24,9.63 18.03,9.83 v18.03,10.11
  Bottom 0.203: PIC_CONTROLLER.9 17.52,11.49 18.03,10.97 v18.03,10.11 | R7.1 16.45,3.91 TEMPSENSE.2
USB_D+@RC5  (via drill 0.3)
  Top 0.178: 19.15,22.87 USB_CON.3 | v14.76,19.56 14.78,19.56
  Top 0.203: 19.15,22.87 19.15,21.57 18.75,21.16 16.38,21.16 14.78,19.56
  Top 0.254: USB_CON.3
  Bottom 0.178: 14.79,19.52 v14.76,19.56
  Bottom 0.203: PIC_CONTROLLER.43 14.79,19.52
USB_D-@RC4  (via drill 0.3)
  Top 0.178: 19.91,22.88 USB_CON.2 19.91,22.91
  Top 0.203: 19.91,22.91 19.91,24.21 19.46,24.66 13.59,24.66 13.31,24.38 13.31,21.82 14.15,20.98 v14.15,19.02
  Bottom 0.178: v14.14,19.02 v14.15,19.02
  Bottom 0.203: PIC_CONTROLLER.42 v14.14,19.02
V_BAT
  Top 0.33: P_MOS_PWR.2 7.94,25.32 C_PWR_BAT.1 6.94,25.02 6.48,25.48 CHARGER.5 6.46,25.28 5.87,24.69 3.66,24.69 2.77,25.58 1.82,25.58 BATT.1
V_SW  (via drill 0.3)
  Top 0.33: 12,24.75 11.35,24.11 2.34,24.11 v1.96,24.49 | 12,24.75 12.01,25.43 P_MOS_PWR.3 | 12,24.75 12.14,24.86 DIOD_PWR.C
  Bottom 0.33: v1.96,24.49 4.15,24.49 4.29,24.45 C_PWR_SW.1 4.62,24.58 4.22,24.99 VOLTAGEREG.P1 VOLTAGEREG.P3 VOLTAGEREG.P2
VUSB  (via drill 0.3)
  Top 0.203: 13.87,26.85 13.89,26.82
  Top 0.33: USB_CON.1 20.73,24.59 19.94,25.38 v19.94,26.85 13.87,26.85 13.36,26.85 13.03,27.18 13.03,28.07 12.3,28.8 DIOD_PWR.A 11.7,29.31 6.6,29.31 6.46,29.17 CHARGER.1 | 13.89,26.82 v13.89,25.88
  Bottom 0.33: C_PWR_VUSB.1 19.93,26.91 v19.94,26.85 | v13.89,25.88 13.89,25.17 14.58,25.17 15.05,24.89 R3.2
WR_OLED@RE1  (via drill 0.3)
  Top 0.203: v5.87,12.14 9.17,12.14 12.85,15.85 21.46,15.85 v21.79,15.52
  Bottom 0.203: PIC_CONTROLLER.26 6.15,12.14 v5.87,12.14 | CON_OLED.P14 22.33,14.99 v21.79,15.52